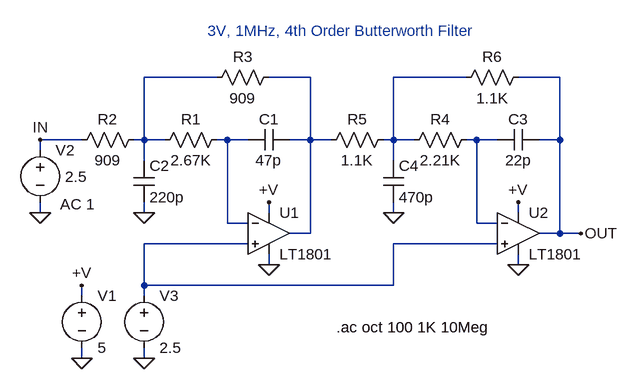
[diagram p0: schematic 1801.asc]
1801.asc, the LTspice schematic file:
Version 4
SHEET 1 896 680
WIRE 112 0 0 0
WIRE 256 0 192 0
WIRE 496 0 384 0
WIRE 640 0 576 0
WIRE -96 96 -160 96
WIRE 0 96 0 0
WIRE 0 96 -16 96
WIRE 32 96 0 96
WIRE 128 96 112 96
WIRE 160 96 128 96
WIRE 256 96 256 0
WIRE 256 96 224 96
WIRE 288 96 256 96
WIRE 384 96 384 0
WIRE 384 96 368 96
WIRE 416 96 384 96
WIRE 512 96 496 96
WIRE 544 96 512 96
WIRE 640 96 640 0
WIRE 640 96 608 96
WIRE -160 112 -160 96
WIRE 0 128 0 96
WIRE 384 128 384 96
WIRE -160 208 -160 192
WIRE 0 208 0 192
WIRE 192 208 192 192
WIRE 384 208 384 192
WIRE 576 208 576 192
WIRE 128 224 128 96
WIRE 160 224 128 224
WIRE 512 224 512 96
WIRE 544 224 512 224
WIRE 256 240 256 96
WIRE 256 240 224 240
WIRE 640 240 640 96
WIRE 640 240 608 240
WIRE 672 240 640 240
WIRE 160 256 0 256
WIRE 544 256 384 256
WIRE 192 288 192 272
WIRE 576 288 576 272
WIRE 0 320 0 256
WIRE 384 320 384 256
WIRE 384 320 0 320
WIRE -96 336 -96 320
WIRE 0 336 0 320
WIRE -96 432 -96 416
WIRE 0 432 0 416
FLAG -96 432 0
FLAG 192 192 +V
FLAG -96 320 +V
FLAG 192 288 0
FLAG 0 208 0
FLAG 576 192 +V
FLAG 576 288 0
FLAG 384 208 0
FLAG -160 208 0
FLAG 0 432 0
FLAG -160 96 IN
FLAG 672 240 OUT
SYMBOL voltage -96 320 R0
SYMATTR InstName V1
SYMATTR Value 5
SYMBOL cap 224 80 R90
WINDOW 0 0 32 VBottom 2
WINDOW 3 32 32 VTop 2
SYMATTR InstName C1
SYMATTR Value 47p
SYMBOL res 128 80 R90
WINDOW 0 0 56 VBottom 2
WINDOW 3 32 56 VTop 2
SYMATTR InstName R1
SYMATTR Value 2.67K
SYMBOL res 0 80 R90
WINDOW 0 0 56 VBottom 2
WINDOW 3 32 56 VTop 2
SYMATTR InstName R2
SYMATTR Value 909
SYMBOL res 96 16 R270
WINDOW 0 32 56 VTop 2
WINDOW 3 0 56 VBottom 2
SYMATTR InstName R3
SYMATTR Value 909
SYMBOL cap -16 128 R0
SYMATTR InstName C2
SYMATTR Value 220p
SYMBOL cap 608 80 R90
WINDOW 0 0 32 VBottom 2
WINDOW 3 32 32 VTop 2
SYMATTR InstName C3
SYMATTR Value 22p
SYMBOL res 512 80 R90
WINDOW 0 0 56 VBottom 2
WINDOW 3 32 56 VTop 2
SYMATTR InstName R4
SYMATTR Value 2.21K
SYMBOL res 384 80 R90
WINDOW 0 0 56 VBottom 2
WINDOW 3 32 56 VTop 2
SYMATTR InstName R5
SYMATTR Value 1.1K
SYMBOL res 480 16 R270
WINDOW 0 32 56 VTop 2
WINDOW 3 0 56 VBottom 2
SYMATTR InstName R6
SYMATTR Value 1.1K
SYMBOL cap 368 128 R0
SYMATTR InstName C4
SYMATTR Value 470p
SYMBOL voltage -160 96 R0
WINDOW 3 38 57 Left 2
WINDOW 123 31 99 Left 2
WINDOW 39 0 0 Left 2
SYMATTR Value 2.5
SYMATTR Value2 AC 1
SYMATTR InstName V2
SYMBOL voltage 0 320 R0
SYMATTR InstName V3
SYMATTR Value 2.5
SYMBOL opamps\\LT1801 192 240 R0
SYMATTR InstName U1
SYMBOL opamps\\LT1801 576 240 R0
SYMATTR InstName U2
TEXT 304 -56 Bottom 2 ;3V, 1MHz, 4th Order Butterworth Filter
TEXT 296 384 Left 2 !.ac oct 100 1K 10Meg

The netlist it stands for:
* 1801.asc
V1 +V 0 5
C1 N002 N004 47p
R1 N004 N001 2.67K
R2 N001 IN 909
R3 N001 N002 909
C2 N001 0 220p
C3 OUT N005 22p
R4 N005 N003 2.21K
R5 N003 N002 1.1K
R6 N003 OUT 1.1K
C4 N003 0 470p
V2 IN 0 2.5 AC 1
V3 N006 0 2.5
* U1: LT1801 (symbol opamps\LT1801 not available, pins judged from their places): In+=N006 In-=N004 V+=+V V-=0 OUT=N002
* U2: LT1801 (symbol opamps\LT1801 not available, pins judged from their places): In+=N006 In-=N005 V+=+V V-=0 OUT=OUT
* 3V, 1MHz, 4th Order Butterworth Filter
.ac oct 100 1K 10Meg
.backanno
.end